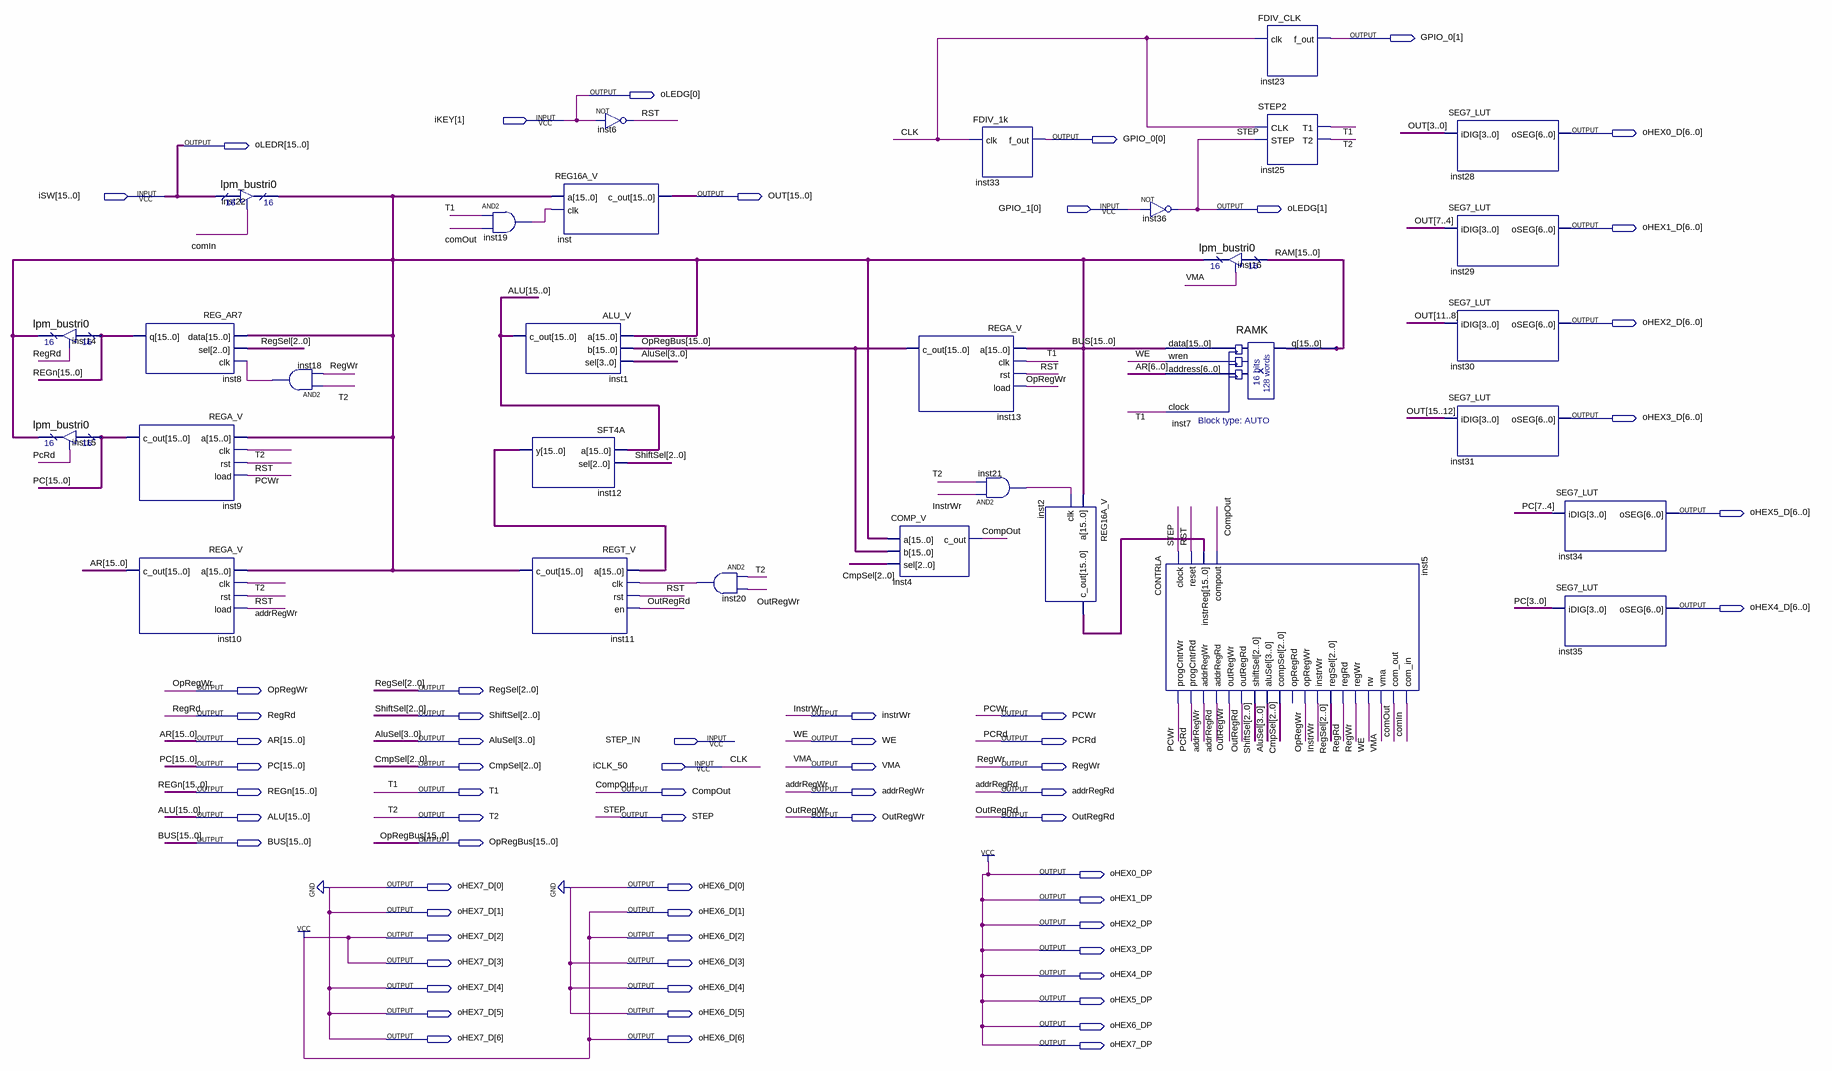
[diagram p0: schematic sheet]
// Quartus schematic kx9016.bdf as structural Verilog: 31 symbols, 65 pins
module kx9016 (
  input  [1:1] iKEY,
  input  [15:0] iSW,
  input  [0:0] GPIO_1,
  input  STEP_IN,
  input  iCLK_50,
  output [1:0] GPIO_0,
  output [1:0] oLEDG,
  output [6:0] oHEX0_D,
  output [15:0] oLEDR,
  output [15:0] OUT,
  output [6:0] oHEX1_D,
  output [6:0] oHEX2_D,
  output [6:0] oHEX3_D,
  output [6:0] oHEX5_D,
  output [6:0] oHEX4_D,
  output OpRegWr,
  output [2:0] RegSel,
  output RegRd,
  output [2:0] ShiftSel,
  output instrWr,
  output PCWr,
  output [15:0] AR,
  output [3:0] AluSel,
  output WE,
  output PCRd,
  output [15:0] PC,
  output [2:0] CmpSel,
  output VMA,
  output RegWr,
  output [15:0] REGn,
  output T1,
  output CompOut,
  output addrRegWr,
  output addrRegRd,
  output [15:0] ALU,
  output T2,
  output STEP,
  output OutRegWr,
  output OutRegRd,
  output [15:0] BUS,
  output [15:0] OpRegBus,
  output oHEX0_DP,
  output [6:0] oHEX7_D,
  output [6:0] oHEX6_D,
  output oHEX1_DP,
  output oHEX2_DP,
  output oHEX3_DP,
  output oHEX4_DP,
  output oHEX5_DP,
  output oHEX6_DP,
  output oHEX7_DP
);

  wire comIn, comOut, inst18_out, inst19_out, inst20_out, inst21_out, RST;
  wire [15:0] inst2_c_out, inst12_y, RAM;

  lpm_bustri0 inst14 (.enabledt(RegRd), .data(REGn), .tridata(BUS));
  lpm_bustri0 inst15 (.enabledt(PCRd), .data(PC), .tridata(BUS));
  REG_AR7 inst8 (.data(BUS), .sel(RegSel), .clk(inst18_out), .q(REGn));
  REGA_V inst9 (.a(BUS), .clk(T2), .rst(RST), .load(PCWr), .c_out(PC));
  REGA_V inst10 (.a(BUS), .clk(T2), .rst(RST), .load(addrRegWr), .c_out(AR));
  lpm_bustri0 inst22 (.enabledt(comIn), .data(iSW), .tridata(BUS));
  and inst18 (inst18_out, T2, RegWr);
  and inst19 (inst19_out, T1, comOut);
  ALU_V inst1 (.a(BUS), .b(OpRegBus), .sel(AluSel), .c_out(ALU));
  SFT4A inst12 (.a(ALU), .sel(ShiftSel), .y(inst12_y));
  REGT_V inst11 (.a(inst12_y), .clk(inst20_out), .rst(RST), .en(OutRegRd), .c_out(BUS));
  REG16A_V inst (.a(BUS), .clk(inst19_out), .c_out(OUT));
  not inst6 (RST, iKEY[1]);
  and inst20 (inst20_out, T2, OutRegWr);
  COMP_V inst4 (.a(BUS), .b(OpRegBus), .sel(CmpSel), .c_out(CompOut));
  REGA_V inst13 (.a(BUS), .clk(T1), .rst(RST), .load(OpRegWr), .c_out(OpRegBus));
  FDIV_1k inst33 (.clk(iCLK_50), .f_out(GPIO_0[0]));
  and inst21 (inst21_out, instrWr, T2);
  REG16A_V inst2 (.a(BUS), .clk(inst21_out), .c_out(inst2_c_out));
  not inst36 (oLEDG[1], GPIO_1[0]);
  RAMK inst7 (.data(BUS), .wren(WE), .address(AR[6:0]), .clock(T1), .q(RAM));
  CONTRLA inst5 (
    .clock(oLEDG[1]), .reset(RST), .instrReg(inst2_c_out), .compout(CompOut), .progCntrWr(PCWr),
    .progCntrRd(PCRd), .addrRegWr(addrRegWr), .addrRegRd(addrRegRd), .outRegWr(OutRegWr),
    .outRegRd(OutRegRd), .shiftSel(ShiftSel), .aluSel(AluSel), .compSel(CmpSel), .opRegWr(OpRegWr),
    .instrWr(instrWr), .regSel(RegSel), .regRd(RegRd), .regWr(RegWr), .rw(WE), .vma(VMA), .com_out(comOut),
    .com_in(comIn));  // open: opRegRd
  lpm_bustri0 inst16 (.enabledt(VMA), .data(RAM), .tridata(BUS));
  FDIV_CLK inst23 (.clk(iCLK_50), .f_out(GPIO_0[1]));
  STEP2 inst25 (.CLK(iCLK_50), .STEP(oLEDG[1]), .T1(T1), .T2(T2));
  SEG7_LUT inst28 (.iDIG(OUT[3:0]), .oSEG(oHEX0_D));
  SEG7_LUT inst29 (.iDIG(OUT[7:4]), .oSEG(oHEX1_D));
  SEG7_LUT inst30 (.iDIG(OUT[11:8]), .oSEG(oHEX2_D));
  SEG7_LUT inst31 (.iDIG(OUT[15:12]), .oSEG(oHEX3_D));
  SEG7_LUT inst34 (.iDIG(PC[7:4]), .oSEG(oHEX5_D));
  SEG7_LUT inst35 (.iDIG(PC[3:0]), .oSEG(oHEX4_D));

  assign oHEX0_DP = 1'b1;
  assign oHEX1_DP = 1'b1;
  assign oHEX2_DP = 1'b1;
  assign oHEX3_DP = 1'b1;
  assign oHEX4_DP = 1'b1;
  assign oHEX5_DP = 1'b1;
  assign oHEX6_D = 7'b1000110;
  assign oHEX6_DP = 1'b1;
  assign oHEX7_D = 7'b0001100;
  assign oHEX7_DP = 1'b1;
  assign oLEDG[0] = iKEY[1];
  assign oLEDR = iSW;
  assign STEP = oLEDG[1];

  // Other names for the same wires on the sheet: CLK = iCLK_50
endmodule
